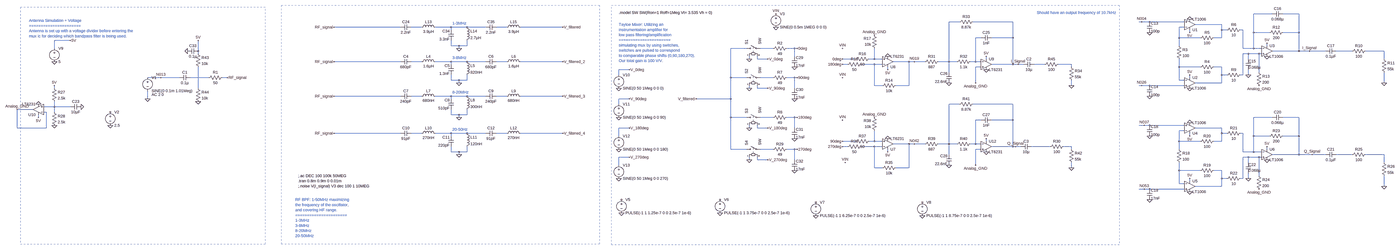
[diagram p0: schematic BypassFilterSim.asc, whole sheet]
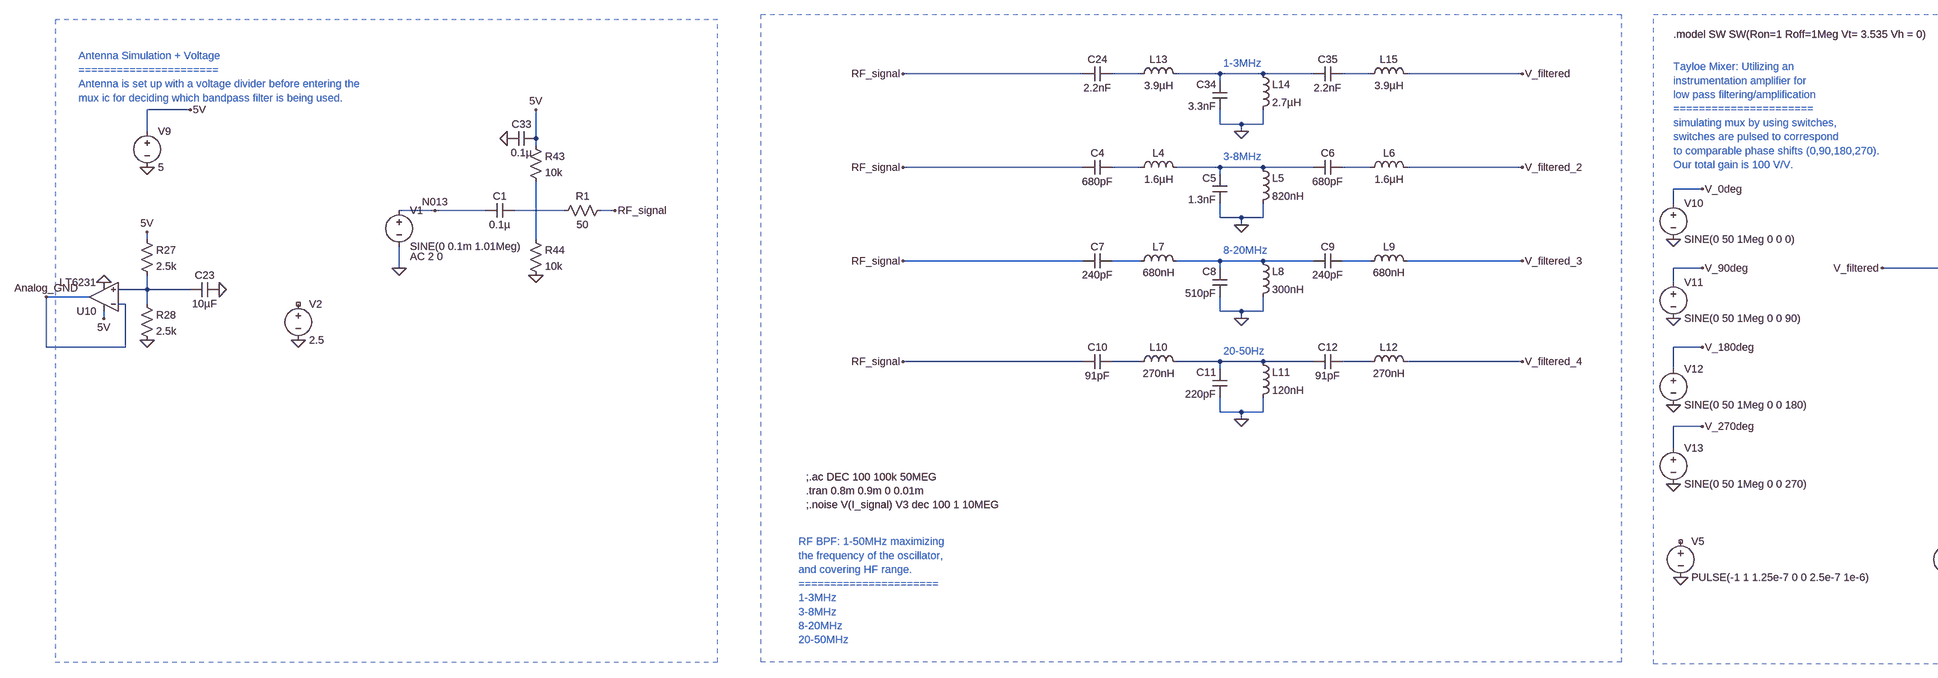
[diagram p1: schematic BypassFilterSim.asc, part, row 1 of 1, column 1 of 2]
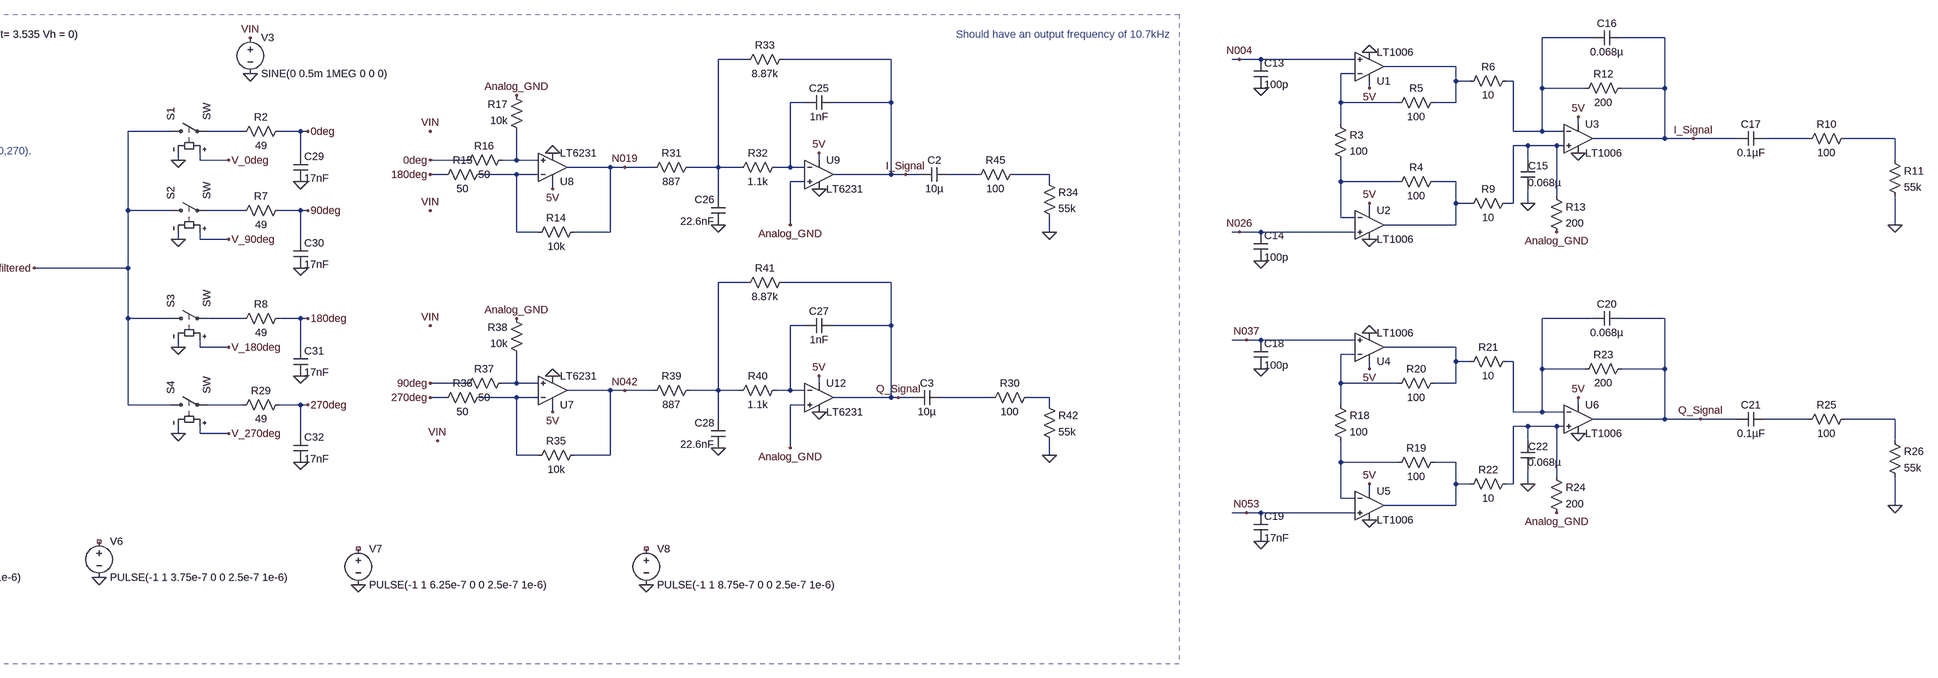
[diagram p2: schematic BypassFilterSim.asc, part, row 1 of 1, column 2 of 2]
BypassFilterSim.asc, the LTspice schematic file:
Version 4
SHEET 1 6228 1616
WIRE 5488 80 5376 80
WIRE 5648 80 5552 80
WIRE 3504 128 3440 128
WIRE 3824 128 3584 128
WIRE 4656 128 4640 128
WIRE 4704 128 4656 128
WIRE 4960 128 4704 128
WIRE 5184 144 5024 144
WIRE 144 160 -256 160
WIRE 272 160 208 160
WIRE 448 160 352 160
WIRE 544 160 448 160
WIRE 656 160 544 160
WIRE 784 160 720 160
WIRE 1120 160 864 160
WIRE 4960 160 4928 160
WIRE 448 176 448 160
WIRE 5184 176 5184 144
WIRE 5216 176 5184 176
WIRE 5312 176 5296 176
WIRE 4992 192 4992 176
WIRE 5376 192 5376 80
WIRE 5472 192 5376 192
WIRE 5648 192 5648 80
WIRE 5648 192 5552 192
WIRE 3632 224 3600 224
WIRE 3824 224 3824 128
WIRE 3824 224 3696 224
WIRE 4928 224 4928 160
WIRE 5056 224 4928 224
WIRE 5184 224 5184 176
WIRE 5184 224 5136 224
WIRE -1840 240 -1936 240
WIRE 448 272 448 240
WIRE 496 272 448 272
WIRE 544 272 544 240
WIRE 544 272 496 272
WIRE 4928 272 4928 224
WIRE 5456 272 5456 256
WIRE -1936 288 -1936 240
WIRE 496 288 496 272
WIRE 2224 288 2128 288
WIRE 2384 288 2304 288
WIRE 2512 288 2464 288
WIRE 2528 288 2512 288
WIRE 5312 288 5312 176
WIRE 5376 288 5376 192
WIRE 5376 288 5312 288
WIRE 5424 288 5376 288
WIRE -1072 304 -1072 240
WIRE 5648 304 5648 192
WIRE 5648 304 5488 304
WIRE 5712 304 5648 304
WIRE 5808 304 5712 304
WIRE 5968 304 5872 304
WIRE 6160 304 6048 304
WIRE -1072 320 -1072 304
WIRE 5344 320 5312 320
WIRE 5408 320 5344 320
WIRE 5424 320 5408 320
WIRE 2512 336 2512 288
WIRE 2240 352 2240 336
WIRE 2288 352 2288 336
WIRE 2352 352 2288 352
WIRE 2880 352 2800 352
WIRE 2992 352 2992 288
WIRE 2992 352 2960 352
WIRE 3040 352 2992 352
WIRE 3664 352 3664 336
WIRE 5344 352 5344 320
WIRE 6160 352 6160 304
WIRE 144 368 -256 368
WIRE 272 368 208 368
WIRE 448 368 352 368
WIRE 544 368 448 368
WIRE 656 368 544 368
WIRE 784 368 720 368
WIRE 1120 368 864 368
WIRE 3200 368 3104 368
WIRE 3232 368 3200 368
WIRE 3296 368 3232 368
WIRE 3440 368 3440 128
WIRE 3440 368 3376 368
WIRE 3488 368 3440 368
WIRE 3600 368 3600 224
WIRE 3600 368 3568 368
WIRE 3632 368 3600 368
WIRE 448 384 448 368
WIRE 2832 384 2800 384
WIRE 2992 384 2912 384
WIRE 3040 384 2992 384
WIRE 3824 384 3824 224
WIRE 3824 384 3696 384
WIRE 3856 384 3824 384
WIRE 3888 384 3856 384
WIRE 4016 384 3952 384
WIRE 4176 384 4096 384
WIRE 3632 400 3600 400
WIRE 4176 400 4176 384
WIRE 4928 400 4928 352
WIRE 5056 400 4928 400
WIRE 5184 400 5136 400
WIRE 1520 416 1456 416
WIRE 3072 416 3072 400
WIRE 3440 432 3440 368
WIRE 5408 432 5408 320
WIRE 1456 448 1456 416
WIRE 5184 448 5184 400
WIRE 5216 448 5184 448
WIRE 5312 448 5312 320
WIRE 5312 448 5296 448
WIRE 5344 448 5344 416
WIRE -1296 464 -1376 464
WIRE -1184 464 -1296 464
WIRE -1008 464 -1120 464
WIRE -896 464 -928 464
WIRE 2128 464 2128 288
WIRE 2224 464 2128 464
WIRE 2384 464 2304 464
WIRE 2512 464 2464 464
WIRE 2528 464 2512 464
WIRE 4992 464 4992 448
WIRE 448 480 448 448
WIRE 496 480 448 480
WIRE 544 480 544 448
WIRE 544 480 496 480
WIRE 4928 480 4928 400
WIRE 4960 480 4928 480
WIRE 496 496 496 480
WIRE 3600 496 3600 400
WIRE 5184 496 5184 448
WIRE 5184 496 5024 496
WIRE 6160 496 6160 432
WIRE 2992 512 2992 384
WIRE 3040 512 2992 512
WIRE 3200 512 3200 368
WIRE 3200 512 3120 512
WIRE 4176 512 4176 480
WIRE 4656 512 4640 512
WIRE 4704 512 4656 512
WIRE 4960 512 4704 512
WIRE -1936 528 -1936 512
WIRE -1072 528 -1072 400
WIRE 2240 528 2240 512
WIRE 2288 528 2288 512
WIRE 2352 528 2288 528
WIRE 2512 528 2512 464
WIRE 144 576 -256 576
WIRE 272 576 208 576
WIRE 448 576 352 576
WIRE 544 576 448 576
WIRE 656 576 544 576
WIRE 784 576 720 576
WIRE 1120 576 864 576
WIRE -1376 592 -1376 544
WIRE 448 592 448 576
WIRE 1520 592 1456 592
WIRE 2128 592 2128 464
WIRE 2128 592 1920 592
WIRE 1456 624 1456 592
WIRE 3504 624 3440 624
WIRE 3824 624 3584 624
WIRE -1936 640 -1936 608
WIRE -1936 640 -2000 640
WIRE -1840 640 -1936 640
WIRE -2064 656 -2160 656
WIRE -1984 672 -2000 672
WIRE -1936 672 -1936 640
WIRE 448 688 448 656
WIRE 496 688 448 688
WIRE 544 688 544 656
WIRE 544 688 496 688
WIRE -2032 704 -2032 688
WIRE 496 704 496 688
WIRE 2128 704 2128 592
WIRE 2224 704 2128 704
WIRE 2384 704 2304 704
WIRE 2512 704 2464 704
WIRE 2528 704 2512 704
WIRE 5488 704 5376 704
WIRE 5648 704 5552 704
WIRE 3632 720 3600 720
WIRE 3824 720 3824 624
WIRE 3824 720 3696 720
WIRE 4672 752 4640 752
WIRE 4704 752 4672 752
WIRE 4960 752 4704 752
WIRE -2160 768 -2160 656
WIRE -1984 768 -1984 672
WIRE -1984 768 -2160 768
WIRE 1520 768 1456 768
WIRE 2240 768 2240 752
WIRE 2288 768 2288 752
WIRE 2352 768 2288 768
WIRE 2512 768 2512 704
WIRE 5184 768 5024 768
WIRE 4960 784 4928 784
WIRE 144 800 -256 800
WIRE 272 800 208 800
WIRE 448 800 352 800
WIRE 544 800 448 800
WIRE 656 800 544 800
WIRE 784 800 720 800
WIRE 1120 800 864 800
WIRE 5184 800 5184 768
WIRE 5216 800 5184 800
WIRE 5312 800 5296 800
WIRE 448 816 448 800
WIRE 1456 816 1456 768
WIRE 4992 816 4992 800
WIRE 5376 816 5376 704
WIRE 5472 816 5376 816
WIRE 5648 816 5648 704
WIRE 5648 816 5552 816
WIRE 2880 848 2800 848
WIRE 2992 848 2992 784
WIRE 2992 848 2960 848
WIRE 3040 848 2992 848
WIRE 3664 848 3664 832
WIRE 4928 848 4928 784
WIRE 5056 848 4928 848
WIRE 5184 848 5184 800
WIRE 5184 848 5136 848
WIRE 3200 864 3104 864
WIRE 3232 864 3200 864
WIRE 3296 864 3232 864
WIRE 3440 864 3440 624
WIRE 3440 864 3376 864
WIRE 3488 864 3440 864
WIRE 3600 864 3600 720
WIRE 3600 864 3568 864
WIRE 3632 864 3600 864
WIRE 2832 880 2800 880
WIRE 2992 880 2912 880
WIRE 3040 880 2992 880
WIRE 3824 880 3824 720
WIRE 3824 880 3696 880
WIRE 3840 880 3824 880
WIRE 3872 880 3840 880
WIRE 4048 880 3936 880
WIRE 4176 880 4128 880
WIRE 2128 896 2128 704
WIRE 2224 896 2128 896
WIRE 2384 896 2304 896
WIRE 2512 896 2464 896
WIRE 2528 896 2512 896
WIRE 3632 896 3600 896
WIRE 4176 896 4176 880
WIRE 4928 896 4928 848
WIRE 5456 896 5456 880
WIRE 448 912 448 880
WIRE 496 912 448 912
WIRE 544 912 544 880
WIRE 544 912 496 912
WIRE 3072 912 3072 896
WIRE 5312 912 5312 800
WIRE 5376 912 5376 816
WIRE 5376 912 5312 912
WIRE 5424 912 5376 912
WIRE 496 928 496 912
WIRE 3440 928 3440 864
WIRE 5648 928 5648 816
WIRE 5648 928 5488 928
WIRE 5728 928 5648 928
WIRE 5808 928 5728 928
WIRE 5968 928 5872 928
WIRE 6160 928 6048 928
WIRE 1520 944 1456 944
WIRE 5344 944 5312 944
WIRE 5408 944 5344 944
WIRE 5424 944 5408 944
WIRE 2240 960 2240 944
WIRE 2288 960 2288 944
WIRE 2352 960 2288 960
WIRE 2512 960 2512 896
WIRE 5344 976 5344 944
WIRE 6160 976 6160 928
WIRE 1456 992 1456 944
WIRE 3600 992 3600 896
WIRE 2992 1008 2992 880
WIRE 3040 1008 2992 1008
WIRE 3200 1008 3200 864
WIRE 3200 1008 3120 1008
WIRE 4176 1008 4176 976
WIRE 4928 1024 4928 976
WIRE 5056 1024 4928 1024
WIRE 5184 1024 5136 1024
WIRE 5408 1056 5408 944
WIRE 5184 1072 5184 1024
WIRE 5216 1072 5184 1072
WIRE 5312 1072 5312 944
WIRE 5312 1072 5296 1072
WIRE 5344 1072 5344 1040
WIRE 4992 1088 4992 1072
WIRE 4928 1104 4928 1024
WIRE 4960 1104 4928 1104
WIRE 5184 1120 5184 1072
WIRE 5184 1120 5024 1120
WIRE 6160 1120 6160 1056
WIRE 4672 1136 4640 1136
WIRE 4704 1136 4672 1136
WIRE 4960 1136 4704 1136
FLAG -1376 592 0
FLAG -1296 464 N013
FLAG 496 496 0
FLAG 496 704 0
FLAG 496 928 0
FLAG 1120 160 V_filtered
FLAG 1120 368 V_filtered_2
FLAG 1120 576 V_filtered_3
FLAG 1120 800 V_filtered_4
FLAG 2240 352 0
FLAG 2240 528 0
FLAG 2240 768 0
FLAG 2240 960 0
FLAG 1920 592 V_filtered
FLAG 2352 352 V_0deg
FLAG 2352 528 V_90deg
FLAG 2352 768 V_180deg
FLAG 2352 960 V_270deg
FLAG 5408 512 Analog_GND
FLAG 5344 448 0
FLAG 4704 576 0
FLAG 4704 192 0
FLAG 6160 496 0
FLAG 4992 112 0
FLAG 4992 528 0
FLAG 4992 192 5V
FLAG 4992 448 5V
FLAG 5456 336 0
FLAG 5456 256 5V
FLAG 5408 1136 Analog_GND
FLAG 5344 1072 0
FLAG 4704 1200 0
FLAG 4704 816 0
FLAG 6160 1120 0
FLAG 4992 736 0
FLAG 4992 1152 0
FLAG 4992 816 5V
FLAG 4992 1072 5V
FLAG 5456 960 0
FLAG 5456 880 5V
FLAG 2528 288 0deg
FLAG 2528 464 90deg
FLAG 2528 704 180deg
FLAG 2528 896 270deg
FLAG 1472 1280 0
FLAG 2064 1280 0
FLAG 2640 1296 0
FLAG 3280 1296 0
FLAG 1520 416 V_0deg
FLAG 1520 592 V_90deg
FLAG 1520 768 V_180deg
FLAG 1520 944 V_270deg
FLAG -1936 368 0
FLAG -1840 240 5V
FLAG -1776 640 0
FLAG -1936 752 0
FLAG -1936 512 5V
FLAG -2160 656 Analog_GND
FLAG 5712 304 I_Signal
FLAG 5728 928 Q_Signal
FLAG 3440 496 0
FLAG 2992 208 Analog_GND
FLAG 3072 336 0
FLAG 3664 416 0
FLAG 3600 496 Analog_GND
FLAG 4176 512 0
FLAG 3664 336 5V
FLAG 3072 416 5V
FLAG 3440 992 0
FLAG 2992 704 Analog_GND
FLAG 3072 832 0
FLAG 3664 912 0
FLAG 3600 992 Analog_GND
FLAG 4176 1008 0
FLAG 3664 832 5V
FLAG 3072 912 5V
FLAG 2800 352 0deg
FLAG 2800 384 180deg
FLAG 2800 848 90deg
FLAG 2800 880 270deg
FLAG 2512 400 0
FLAG 2512 592 0
FLAG 2512 832 0
FLAG 2512 1024 0
FLAG 4656 128 N004
FLAG 4656 512 N026
FLAG 4672 752 N037
FLAG 4672 1136 N053
FLAG 1456 528 0
FLAG 1456 704 0
FLAG 1456 896 0
FLAG 1456 1072 0
FLAG 3856 384 I_Signal
FLAG 3840 880 Q_Signal
FLAG -1072 608 0
FLAG -1072 240 5V
FLAG -1136 304 0
FLAG 496 288 0
FLAG -896 464 RF_signal
FLAG -256 160 RF_signal
FLAG -256 368 RF_signal
FLAG -256 576 RF_signal
FLAG -256 800 RF_signal
FLAG 3232 368 N019
FLAG 3232 864 N042
FLAG -1600 752 0
FLAG -2032 624 0
FLAG -2032 704 5V
FLAG 2400 80 VIN
FLAG 2800 288 VIN
FLAG 2800 464 VIN
FLAG 2800 720 VIN
FLAG 2816 976 VIN
FLAG 2400 160 0
SYMBOL voltage -1376 448 R0
WINDOW 123 24 118 Left 2
SYMATTR Value2 AC 2 0
SYMATTR InstName V1
SYMATTR Value SINE(0 0.1m 1.01Meg)
SYMBOL res -912 448 R90
WINDOW 0 0 56 VBottom 2
WINDOW 3 32 56 VTop 2
SYMATTR InstName R1
SYMATTR Value 50
SYMBOL cap 208 352 R90
WINDOW 0 0 32 VBottom 2
WINDOW 3 32 32 VTop 2
SYMATTR InstName C4
SYMATTR Value 680pF
SYMBOL cap 464 448 R180
WINDOW 0 24 56 Left 2
WINDOW 3 24 8 Left 2
SYMATTR InstName C5
SYMATTR Value 1.3nF
SYMBOL cap 656 384 R270
WINDOW 0 32 32 VTop 2
WINDOW 3 0 32 VBottom 2
SYMATTR InstName C6
SYMATTR Value 680pF
SYMBOL ind 256 384 R270
WINDOW 0 32 56 VTop 2
WINDOW 3 5 56 VBottom 2
SYMATTR InstName L4
SYMATTR Value 1.6µH
SYMBOL ind 528 352 R0
SYMATTR InstName L5
SYMATTR Value 820nH
SYMBOL ind 768 384 R270
WINDOW 0 32 56 VTop 2
WINDOW 3 5 56 VBottom 2
SYMATTR InstName L6
SYMATTR Value 1.6µH
SYMBOL cap 208 560 R90
WINDOW 0 0 32 VBottom 2
WINDOW 3 32 32 VTop 2
SYMATTR InstName C7
SYMATTR Value 240pF
SYMBOL cap 464 656 R180
WINDOW 0 24 56 Left 2
WINDOW 3 24 8 Left 2
SYMATTR InstName C8
SYMATTR Value 510pF
SYMBOL cap 656 592 R270
WINDOW 0 32 32 VTop 2
WINDOW 3 0 32 VBottom 2
SYMATTR InstName C9
SYMATTR Value 240pF
SYMBOL ind 256 592 R270
WINDOW 0 32 56 VTop 2
WINDOW 3 5 56 VBottom 2
SYMATTR InstName L7
SYMATTR Value 680nH
SYMBOL ind 528 560 R0
SYMATTR InstName L8
SYMATTR Value 300nH
SYMBOL ind 768 592 R270
WINDOW 0 32 56 VTop 2
WINDOW 3 5 56 VBottom 2
SYMATTR InstName L9
SYMATTR Value 680nH
SYMBOL cap 208 784 R90
WINDOW 0 0 32 VBottom 2
WINDOW 3 32 32 VTop 2
SYMATTR InstName C10
SYMATTR Value 91pF
SYMBOL cap 464 880 R180
WINDOW 0 24 56 Left 2
WINDOW 3 24 8 Left 2
SYMATTR InstName C11
SYMATTR Value 220pF
SYMBOL cap 656 816 R270
WINDOW 0 32 32 VTop 2
WINDOW 3 0 32 VBottom 2
SYMATTR InstName C12
SYMATTR Value 91pF
SYMBOL ind 256 816 R270
WINDOW 0 32 56 VTop 2
WINDOW 3 5 56 VBottom 2
SYMATTR InstName L10
SYMATTR Value 270nH
SYMBOL ind 528 784 R0
SYMATTR InstName L11
SYMATTR Value 120nH
SYMBOL ind 768 816 R270
WINDOW 0 32 56 VTop 2
WINDOW 3 5 56 VBottom 2
SYMATTR InstName L12
SYMATTR Value 270nH
SYMBOL sw 2208 288 R270
SYMATTR InstName S1
SYMBOL sw 2208 464 R270
SYMATTR InstName S2
SYMBOL sw 2208 704 R270
SYMATTR InstName S3
SYMBOL sw 2208 896 R270
SYMATTR InstName S4
SYMBOL Opamps/LT1006 4992 208 M180
SYMATTR InstName U1
SYMBOL Opamps/LT1006 4992 432 R0
SYMATTR InstName U2
SYMBOL Opamps/LT1006 5456 240 R0
SYMATTR InstName U3
SYMBOL res 4912 256 R0
SYMATTR InstName R3
SYMATTR Value 100
SYMBOL res 5152 384 R90
WINDOW 0 0 56 VBottom 2
WINDOW 3 32 56 VTop 2
SYMATTR InstName R4
SYMATTR Value 100
SYMBOL res 5152 208 R90
WINDOW 0 0 56 VBottom 2
WINDOW 3 32 56 VTop 2
SYMATTR InstName R5
SYMATTR Value 100
SYMBOL res 5312 160 R90
WINDOW 0 0 56 VBottom 2
WINDOW 3 32 56 VTop 2
SYMATTR InstName R6
SYMATTR Value 10
SYMBOL res 5312 432 R90
WINDOW 0 0 56 VBottom 2
WINDOW 3 32 56 VTop 2
SYMATTR InstName R9
SYMATTR Value 10
SYMBOL cap 4688 128 R0
SYMATTR InstName C13
SYMATTR Value 100p
SYMBOL cap 4688 512 R0
SYMATTR InstName C14
SYMATTR Value 100p
SYMBOL cap 5552 64 R90
WINDOW 0 0 32 VBottom 2
WINDOW 3 32 32 VTop 2
SYMATTR InstName C16
SYMATTR Value 0.068µ
SYMBOL res 5568 176 R90
WINDOW 0 0 56 VBottom 2
WINDOW 3 32 56 VTop 2
SYMATTR InstName R12
SYMATTR Value 200
SYMBOL res 5392 416 R0
SYMATTR InstName R13
SYMATTR Value 200
SYMBOL res 6064 288 R90
WINDOW 0 0 56 VBottom 2
WINDOW 3 32 56 VTop 2
SYMATTR InstName R10
SYMATTR Value 100
SYMBOL cap 5872 288 R90
WINDOW 0 0 32 VBottom 2
WINDOW 3 32 32 VTop 2
SYMATTR InstName C17
SYMATTR Value 0.1µF
SYMBOL res 6144 336 R0
SYMATTR InstName R11
SYMATTR Value 55k
SYMBOL cap 5360 416 R180
WINDOW 0 15 51 Right 2
WINDOW 3 16 14 Right 2
SYMATTR InstName C15
SYMATTR Value 0.068µ
SYMBOL Opamps/LT1006 4992 832 M180
SYMATTR InstName U4
SYMBOL Opamps/LT1006 4992 1056 R0
SYMATTR InstName U5
SYMBOL Opamps/LT1006 5456 864 R0
SYMATTR InstName U6
SYMBOL res 4912 880 R0
SYMATTR InstName R18
SYMATTR Value 100
SYMBOL res 5152 1008 R90
WINDOW 0 0 56 VBottom 2
WINDOW 3 32 56 VTop 2
SYMATTR InstName R19
SYMATTR Value 100
SYMBOL res 5152 832 R90
WINDOW 0 0 56 VBottom 2
WINDOW 3 32 56 VTop 2
SYMATTR InstName R20
SYMATTR Value 100
SYMBOL res 5312 784 R90
WINDOW 0 0 56 VBottom 2
WINDOW 3 32 56 VTop 2
SYMATTR InstName R21
SYMATTR Value 10
SYMBOL res 5312 1056 R90
WINDOW 0 0 56 VBottom 2
WINDOW 3 32 56 VTop 2
SYMATTR InstName R22
SYMATTR Value 10
SYMBOL cap 4688 752 R0
SYMATTR InstName C18
SYMATTR Value 100p
SYMBOL cap 4688 1136 R0
SYMATTR InstName C19
SYMATTR Value 17nF
SYMBOL cap 5552 688 R90
WINDOW 0 0 32 VBottom 2
WINDOW 3 32 32 VTop 2
SYMATTR InstName C20
SYMATTR Value 0.068µ
SYMBOL res 5568 800 R90
WINDOW 0 0 56 VBottom 2
WINDOW 3 32 56 VTop 2
SYMATTR InstName R23
SYMATTR Value 200
SYMBOL res 5392 1040 R0
SYMATTR InstName R24
SYMATTR Value 200
SYMBOL res 6064 912 R90
WINDOW 0 0 56 VBottom 2
WINDOW 3 32 56 VTop 2
SYMATTR InstName R25
SYMATTR Value 100
SYMBOL cap 5872 912 R90
WINDOW 0 0 32 VBottom 2
WINDOW 3 32 32 VTop 2
SYMATTR InstName C21
SYMATTR Value 0.1µF
SYMBOL res 6144 960 R0
SYMATTR InstName R26
SYMATTR Value 55k
SYMBOL cap 5360 1040 R180
WINDOW 0 15 51 Right 2
WINDOW 3 16 16 Right 2
SYMATTR InstName C22
SYMATTR Value 0.068µ
SYMBOL voltage 1472 1184 R0
SYMATTR InstName V5
SYMATTR Value PULSE(-1 1 1.25e-7 0 0 2.5e-7 1e-6)
SYMBOL voltage 2064 1184 R0
SYMATTR InstName V6
SYMATTR Value PULSE(-1 1 3.75e-7 0 0 2.5e-7 1e-6)
SYMBOL voltage 2640 1200 R0
SYMATTR InstName V7
SYMATTR Value PULSE(-1 1 6.25e-7 0 0 2.5e-7 1e-6)
SYMBOL voltage 3280 1200 R0
SYMATTR InstName V8
SYMATTR Value PULSE(-1 1 8.75e-7 0 0 2.5e-7 1e-6)
SYMBOL voltage -1936 272 R0
SYMATTR InstName V9
SYMATTR Value 5
SYMBOL res -1952 512 R0
SYMATTR InstName R27
SYMATTR Value 2.5k
SYMBOL res -1952 656 R0
SYMATTR InstName R28
SYMATTR Value 2.5k
SYMBOL cap -1776 624 R90
WINDOW 0 0 32 VBottom 2
WINDOW 3 32 32 VTop 2
SYMATTR InstName C23
SYMATTR Value 10µF
SYMBOL res 3136 496 R90
WINDOW 0 0 56 VBottom 2
WINDOW 3 32 56 VTop 2
SYMATTR InstName R14
SYMATTR Value 10k
SYMBOL res 3008 304 R180
WINDOW 0 36 76 Left 2
WINDOW 3 36 40 Left 2
SYMATTR InstName R17
SYMATTR Value 10k
SYMBOL res 3392 352 R90
WINDOW 0 0 56 VBottom 2
WINDOW 3 32 56 VTop 2
SYMATTR InstName R31
SYMATTR Value 887
SYMBOL res 3584 352 R90
WINDOW 0 0 56 VBottom 2
WINDOW 3 32 56 VTop 2
SYMATTR InstName R32
SYMATTR Value 1.1k
SYMBOL cap 3696 208 R90
WINDOW 0 0 32 VBottom 2
WINDOW 3 32 32 VTop 2
SYMATTR InstName C25
SYMATTR Value 1nF
SYMBOL cap 3456 496 R180
WINDOW 0 24 56 Left 2
WINDOW 3 24 8 Left 2
SYMATTR InstName C26
SYMATTR Value 22.6nF
SYMBOL res 3600 112 R90
WINDOW 0 0 56 VBottom 2
WINDOW 3 32 56 VTop 2
SYMATTR InstName R33
SYMATTR Value 8.87k
SYMBOL res 4160 384 R0
SYMATTR InstName R34
SYMATTR Value 55k
SYMBOL res 3136 992 R90
WINDOW 0 0 56 VBottom 2
WINDOW 3 32 56 VTop 2
SYMATTR InstName R35
SYMATTR Value 10k
SYMBOL res 3008 800 R180
WINDOW 0 36 76 Left 2
WINDOW 3 36 40 Left 2
SYMATTR InstName R38
SYMATTR Value 10k
SYMBOL res 3392 848 R90
WINDOW 0 0 56 VBottom 2
WINDOW 3 32 56 VTop 2
SYMATTR InstName R39
SYMATTR Value 887
SYMBOL res 3584 848 R90
WINDOW 0 0 56 VBottom 2
WINDOW 3 32 56 VTop 2
SYMATTR InstName R40
SYMATTR Value 1.1k
SYMBOL cap 3696 704 R90
WINDOW 0 0 32 VBottom 2
WINDOW 3 32 32 VTop 2
SYMATTR InstName C27
SYMATTR Value 1nF
SYMBOL cap 3456 992 R180
WINDOW 0 24 56 Left 2
WINDOW 3 24 8 Left 2
SYMATTR InstName C28
SYMATTR Value 22.6nF
SYMBOL res 3600 608 R90
WINDOW 0 0 56 VBottom 2
WINDOW 3 32 56 VTop 2
SYMATTR InstName R41
SYMATTR Value 8.87k
SYMBOL res 4160 880 R0
SYMATTR InstName R42
SYMATTR Value 55k
SYMBOL cap 2496 336 R0
SYMATTR InstName C29
SYMATTR Value 17nF
SYMBOL cap 2496 528 R0
SYMATTR InstName C30
SYMATTR Value 17nF
SYMBOL cap 2496 768 R0
SYMATTR InstName C31
SYMATTR Value 17nF
SYMBOL cap 2496 960 R0
SYMATTR InstName C32
SYMATTR Value 17nF
SYMBOL res 2928 368 R90
WINDOW 0 0 56 VBottom 2
WINDOW 3 32 56 VTop 2
SYMATTR InstName R15
SYMATTR Value 50
SYMBOL res 2976 336 R90
WINDOW 0 0 56 VBottom 2
WINDOW 3 32 56 VTop 2
SYMATTR InstName R16
SYMATTR Value 50
SYMBOL res 2928 864 R90
WINDOW 0 0 56 VBottom 2
WINDOW 3 32 56 VTop 2
SYMATTR InstName R36
SYMATTR Value 50
SYMBOL res 2976 832 R90
WINDOW 0 0 56 VBottom 2
WINDOW 3 32 56 VTop 2
SYMATTR InstName R37
SYMATTR Value 50
SYMBOL voltage 1456 432 R0
SYMATTR InstName V10
SYMATTR Value SINE(0 50 1Meg 0 0 0)
SYMBOL voltage 1456 608 R0
SYMATTR InstName V11
SYMATTR Value SINE(0 50 1Meg 0 0 90)
SYMBOL voltage 1456 800 R0
SYMATTR InstName V12
SYMATTR Value SINE(0 50 1Meg 0 0 180)
SYMBOL voltage 1456 976 R0
SYMATTR InstName V13
SYMATTR Value SINE(0 50 1Meg 0 0 270)
SYMBOL res -1088 304 R0
SYMATTR InstName R43
SYMATTR Value 10k
SYMBOL res -1088 512 R0
SYMATTR InstName R44
SYMATTR Value 10k
SYMBOL cap -1072 288 R90
WINDOW 0 0 32 VBottom 2
WINDOW 3 32 32 VTop 2
SYMATTR InstName C33
SYMATTR Value 0.1µ
SYMBOL cap 208 144 R90
WINDOW 0 0 32 VBottom 2
WINDOW 3 32 32 VTop 2
SYMATTR InstName C24
SYMATTR Value 2.2nF
SYMBOL cap 464 240 R180
WINDOW 0 24 56 Left 2
WINDOW 3 24 8 Left 2
SYMATTR InstName C34
SYMATTR Value 3.3nF
SYMBOL cap 656 176 R270
WINDOW 0 32 32 VTop 2
WINDOW 3 0 32 VBottom 2
SYMATTR InstName C35
SYMATTR Value 2.2nF
SYMBOL ind 256 176 R270
WINDOW 0 32 56 VTop 2
WINDOW 3 5 56 VBottom 2
SYMATTR InstName L13
SYMATTR Value 3.9µH
SYMBOL ind 528 144 R0
SYMATTR InstName L14
SYMATTR Value 2.7µH
SYMBOL ind 768 176 R270
WINDOW 0 32 56 VTop 2
WINDOW 3 5 56 VBottom 2
SYMATTR InstName L15
SYMATTR Value 3.9µH
SYMBOL cap -1120 448 R90
WINDOW 0 0 32 VBottom 2
WINDOW 3 32 32 VTop 2
SYMATTR InstName C1
SYMATTR Value 0.1µ
SYMBOL res 2480 272 R90
WINDOW 0 0 56 VBottom 2
WINDOW 3 32 56 VTop 2
SYMATTR InstName R2
SYMATTR Value 49
SYMBOL res 2480 448 R90
WINDOW 0 0 56 VBottom 2
WINDOW 3 32 56 VTop 2
SYMATTR InstName R7
SYMATTR Value 49
SYMBOL res 2480 688 R90
WINDOW 0 0 56 VBottom 2
WINDOW 3 32 56 VTop 2
SYMATTR InstName R8
SYMATTR Value 49
SYMBOL res 2480 880 R90
WINDOW 0 0 56 VBottom 2
WINDOW 3 32 56 VTop 2
SYMATTR InstName R29
SYMATTR Value 49
SYMBOL voltage -1600 656 R0
SYMATTR InstName V2
SYMATTR Value 2.5
SYMBOL cap 3952 368 R90
WINDOW 0 0 32 VBottom 2
WINDOW 3 32 32 VTop 2
SYMATTR InstName C2
SYMATTR Value 10µ
SYMBOL cap 3936 864 R90
WINDOW 0 0 32 VBottom 2
WINDOW 3 32 32 VTop 2
SYMATTR InstName C3
SYMATTR Value 10µ
SYMBOL res 4144 864 R90
WINDOW 0 0 56 VBottom 2
WINDOW 3 32 56 VTop 2
SYMATTR InstName R30
SYMATTR Value 100
SYMBOL res 4112 368 R90
WINDOW 0 0 56 VBottom 2
WINDOW 3 32 56 VTop 2
SYMATTR InstName R45
SYMATTR Value 100
SYMBOL Opamps/LT6231 3664 880 R0
SYMATTR InstName U12
SYMBOL Opamps/LT6231 3664 384 R0
SYMATTR InstName U9
SYMBOL Opamps/LT6231 3072 864 M180
SYMATTR InstName U7
SYMBOL Opamps/LT6231 3072 368 M180
SYMATTR InstName U8
SYMBOL Opamps/LT6231 -2032 656 R180
SYMATTR InstName U10
SYMBOL voltage 2400 64 R0
SYMATTR InstName V3
SYMATTR Value SINE(0 0.5m 1MEG 0 0 0)
TEXT -488 1200 Left 2 ;RF BPF: 1-50MHz maximizing \nthe frequency of the oscillator,\nand covering HF range.\n======================\n1-3MHz\n3-8MHz\n8-20MHz\n20-50MHz
TEXT -472 1056 Left 2 !;.ac DEC 100 100k 50MEG\n.tran 0.8m 0.9m 0 0.01m\n;.noise V(I_signal) V3 dec 100 1 10MEG
TEXT 456 344 Left 2 ;3-8MHz
TEXT 456 552 Left 2 ;8-20MHz
TEXT 456 776 Left 2 ;20-50Hz
TEXT -2088 120 Left 2 ;Antenna Simulation + Voltage \n======================\nAntenna is set up with a voltage divider before entering the \nmux ic for deciding which bandpass filter is being used.
TEXT 1456 144 Left 2 ;Tayloe Mixer: Utilizing an \ninstrumentation amplifier for \nlow pass filtering/amplification\n======================\nsimulating mux by using switches,\nswitches are pulsed to correspond\nto comparable phase shifts (0,90,180,270).\nOur total gain is 100 V/V.
TEXT 1456 72 Left 2 !.model SW SW(Ron=1 Roff=1Meg Vt= 3.535 Vh = 0)
TEXT 3968 72 Left 2 ;Should have an output frequency of 10.7kHz
TEXT 456 136 Left 2 ;1-3MHz
RECTANGLE Normal -572 28 1340 1468 2
RECTANGLE Normal 1412 28 4464 1472 2
RECTANGLE Normal -668 40 -2140 1468 2

The netlist it stands for:
* BypassFilterSim.asc
V1 N013 0 SINE(0 0.1m 1.01Meg) AC 2 0
R1 RF_signal N025 50
C4 N016 RF_signal 680pF
C5 0 N017 1.3nF
C6 N017 N018 680pF
L4 N016 N017 1.6µH
L5 N017 0 820nH
L6 N018 V_filtered_2 1.6µH
C7 N029 RF_signal 240pF
C8 0 N030 510pF
C9 N030 N031 240pF
L7 N029 N030 680nH
L8 N030 0 300nH
L9 N031 V_filtered_3 680nH
C10 N040 RF_signal 91pF
C11 0 N041 220pF
C12 N041 N043 91pF
L10 N040 N041 270nH
L11 N041 0 120nH
L12 N043 V_filtered_4 270nH
S1 V_filtered N010 V_0deg 0 SW
S2 V_filtered N027 V_90deg 0 SW
S3 V_filtered N034 V_180deg 0 SW
S4 V_filtered N048 V_270deg 0 SW
XU1 N004 N008 5V 0 N003 LT1006  ; pins In+ In- V+ V- OUT
XU2 N026 N023 5V 0 N024 LT1006  ; pins In+ In- V+ V- OUT
XU3 N014 N001 5V 0 I_Signal LT1006  ; pins In+ In- V+ V- OUT
R3 N008 N023 100
R4 N024 N023 100
R5 N003 N008 100
R6 N001 N003 10
R9 N014 N024 10
C13 N004 0 100p
C14 N026 0 100p
C16 I_Signal N001 0.068µ
R12 I_Signal N001 200
R13 N014 Analog_GND 200
R10 N012 N011 100
C17 N011 I_Signal 0.1µF
R11 N012 0 55k
C15 0 N014 0.068µ
XU4 N037 N039 5V 0 N038 LT1006  ; pins In+ In- V+ V- OUT
XU5 N053 N052 5V 0 N054 LT1006  ; pins In+ In- V+ V- OUT
XU6 N051 N035 5V 0 Q_Signal LT1006  ; pins In+ In- V+ V- OUT
R18 N039 N052 100
R19 N054 N052 100
R20 N038 N039 100
R21 N035 N038 10
R22 N051 N054 10
C18 N037 0 100p
C19 N053 0 17nF
C20 Q_Signal N035 0.068µ
R23 Q_Signal N035 200
R24 N051 Analog_GND 200
R25 N050 N049 100
C21 N049 Q_Signal 0.1µF
R26 N050 0 55k
C22 0 N051 0.068µ
V5 NC_01 0 PULSE(-1 1 1.25e-7 0 0 2.5e-7 1e-6)
V6 NC_02 0 PULSE(-1 1 3.75e-7 0 0 2.5e-7 1e-6)
V7 NC_03 0 PULSE(-1 1 6.25e-7 0 0 2.5e-7 1e-6)
V8 NC_04 0 PULSE(-1 1 8.75e-7 0 0 2.5e-7 1e-6)
V9 5V 0 5
R27 5V N033 2.5k
R28 N033 0 2.5k
C23 0 N033 10µF
R14 N019 N020 10k
R17 N015 Analog_GND 10k
R31 N002 N019 887
R32 N009 N002 1.1k
C25 I_Signal N009 1nF
C26 0 N002 22.6nF
R33 I_Signal N002 8.87k
R34 N022 0 55k
R35 N042 N045 10k
R38 N044 Analog_GND 10k
R39 N032 N042 887
R40 N036 N032 1.1k
C27 Q_Signal N036 1nF
C28 0 N032 22.6nF
R41 Q_Signal N032 8.87k
R42 N047 0 55k
C29 0deg 0 17nF
C30 90deg 0 17nF
C31 180deg 0 17nF
C32 270deg 0 17nF
R15 N020 180deg 50
R16 N015 0deg 50
R36 N045 270deg 50
R37 N044 90deg 50
V10 V_0deg 0 SINE(0 50 1Meg 0 0 0)
V11 V_90deg 0 SINE(0 50 1Meg 0 0 90)
V12 V_180deg 0 SINE(0 50 1Meg 0 0 180)
V13 V_270deg 0 SINE(0 50 1Meg 0 0 270)
R43 5V N028 10k
R44 N028 0 10k
C33 5V 0 0.1µ
C24 N005 RF_signal 2.2nF
C34 0 N006 3.3nF
C35 N006 N007 2.2nF
L13 N005 N006 3.9µH
L14 N006 0 2.7µH
L15 N007 V_filtered 3.9µH
C1 N025 N013 0.1µ
R2 0deg N010 49
R7 90deg N027 49
R8 180deg N034 49
R29 270deg N048 49
V2 NC_05 0 2.5
C2 N021 I_Signal 10µ
C3 N046 Q_Signal 10µ
R30 N047 N046 100
R45 N022 N021 100
XU12 Analog_GND N036 Q_Signal 5V 0 LT6231  ; pins In+ In- OUT V+ V-
XU9 Analog_GND N009 I_Signal 5V 0 LT6231  ; pins In+ In- OUT V+ V-
XU7 N044 N045 N042 5V 0 LT6231  ; pins In+ In- OUT V+ V-
XU8 N015 N020 N019 5V 0 LT6231  ; pins In+ In- OUT V+ V-
XU10 N033 Analog_GND Analog_GND 5V 0 LT6231  ; pins In+ In- OUT V+ V-
V3 VIN 0 SINE(0 0.5m 1MEG 0 0 0)
* RF BPF: 1-50MHz maximizing
* the frequency of the oscillator,
* and covering HF range.
* ======================
* 1-3MHz
* 3-8MHz
* 8-20MHz
* 20-50MHz
;.ac DEC 100 100k 50MEG
.tran 0.8m 0.9m 0 0.01m
;.noise V(I_signal) V3 dec 100 1 10MEG
* 3-8MHz
* 8-20MHz
* 20-50Hz
* Antenna Simulation + Voltage
* ======================
* Antenna is set up with a voltage divider before entering the
* mux ic for deciding which bandpass filter is being used.
* Tayloe Mixer: Utilizing an
* instrumentation amplifier for
* low pass filtering/amplification
* ======================
* simulating mux by using switches,
* switches are pulsed to correspond
* to comparable phase shifts (0,90,180,270).
* Our total gain is 100 V/V.
.model SW SW(Ron=1 Roff=1Meg Vt= 3.535 Vh = 0)
* Should have an output frequency of 10.7kHz
* 1-3MHz
.lib LTC.lib
.lib LTC2.lib
.backanno
.end